# Altium schematic sheet ChillerSystem.SchDoc
size A
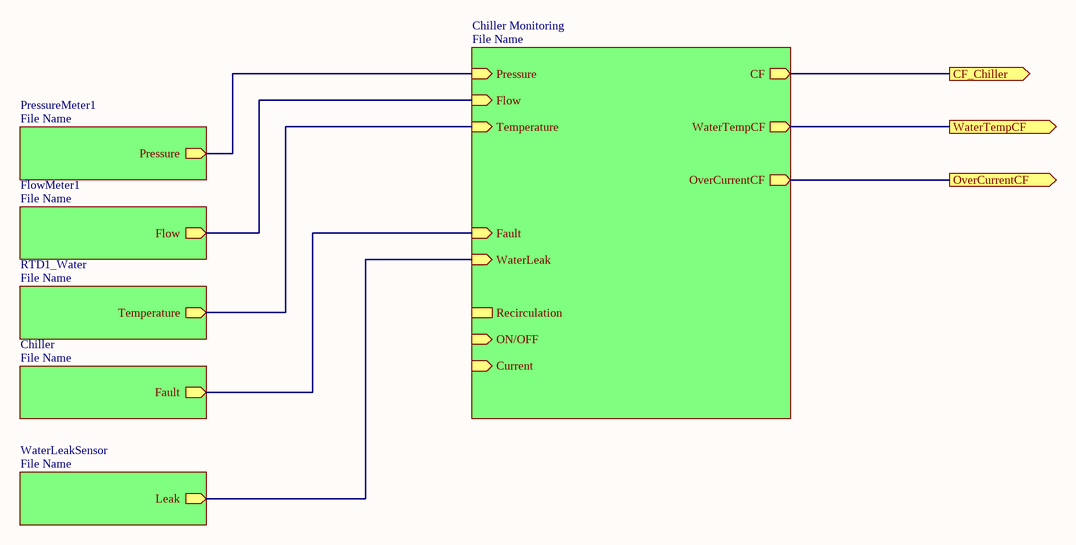
[diagram p0: ChillerSystem.SchDoc]

## Sub-sheets
Chiller = File Name: Fault (out)
Chiller Monitoring = File Name: Pressure (in), Flow (in), Temperature (in), Current (in), Recirculation, ON/OFF (in), CF (out), Fault (in), WaterLeak (in), WaterTempCF (out), OverCurrentCF (out)
FlowMeter1 = File Name: Flow (out)
PressureMeter1 = File Name: Pressure (out)
RTD1_Water = File Name: Temperature (out)
WaterLeakSensor = File Name: Leak (out)

## Ports
CF_Chiller (out), OverCurrentCF (out), WaterTempCF (out)

## Nets
CF_Chiller: port CF_Chiller, sheet Chiller Monitoring/CF
OverCurrentCF: port OverCurrentCF, sheet Chiller Monitoring/OverCurrentCF
WaterTempCF: port WaterTempCF, sheet Chiller Monitoring/WaterTempCF
(unnamed): sheet Chiller Monitoring/Pressure, sheet PressureMeter1/Pressure
(unnamed): sheet Chiller Monitoring/Flow, sheet FlowMeter1/Flow
(unnamed): sheet Chiller Monitoring/Temperature, sheet RTD1_Water/Temperature
(unnamed): sheet Chiller Monitoring/Fault, sheet Chiller/Fault
(unnamed): sheet Chiller Monitoring/WaterLeak, sheet WaterLeakSensor/Leak